# Altium schematic sheet FIT_TCM.SchDoc: FIT_PM12 board
size 420 x 297 mm; CheckedBy: G.Kasprowicz; Author: INR Moscow; CompanyName: WUT ISE; DrawnBy: M.Podgórski; Organization: WUT ISE; Address1: PW ISE; Address2: Nowowiejska 15/19 00-665 Warsaw; Address3: gkasprow@gmail.com; Revision: 2; SheetNumber: -; SheetTotal: -; ModifiedBy: -; CheckedDate: -; Title2: Title 2; DivGrp: WUT ISE; Designer: INR RAS; ModifiedDate: -; ProjectName: Sensor Box
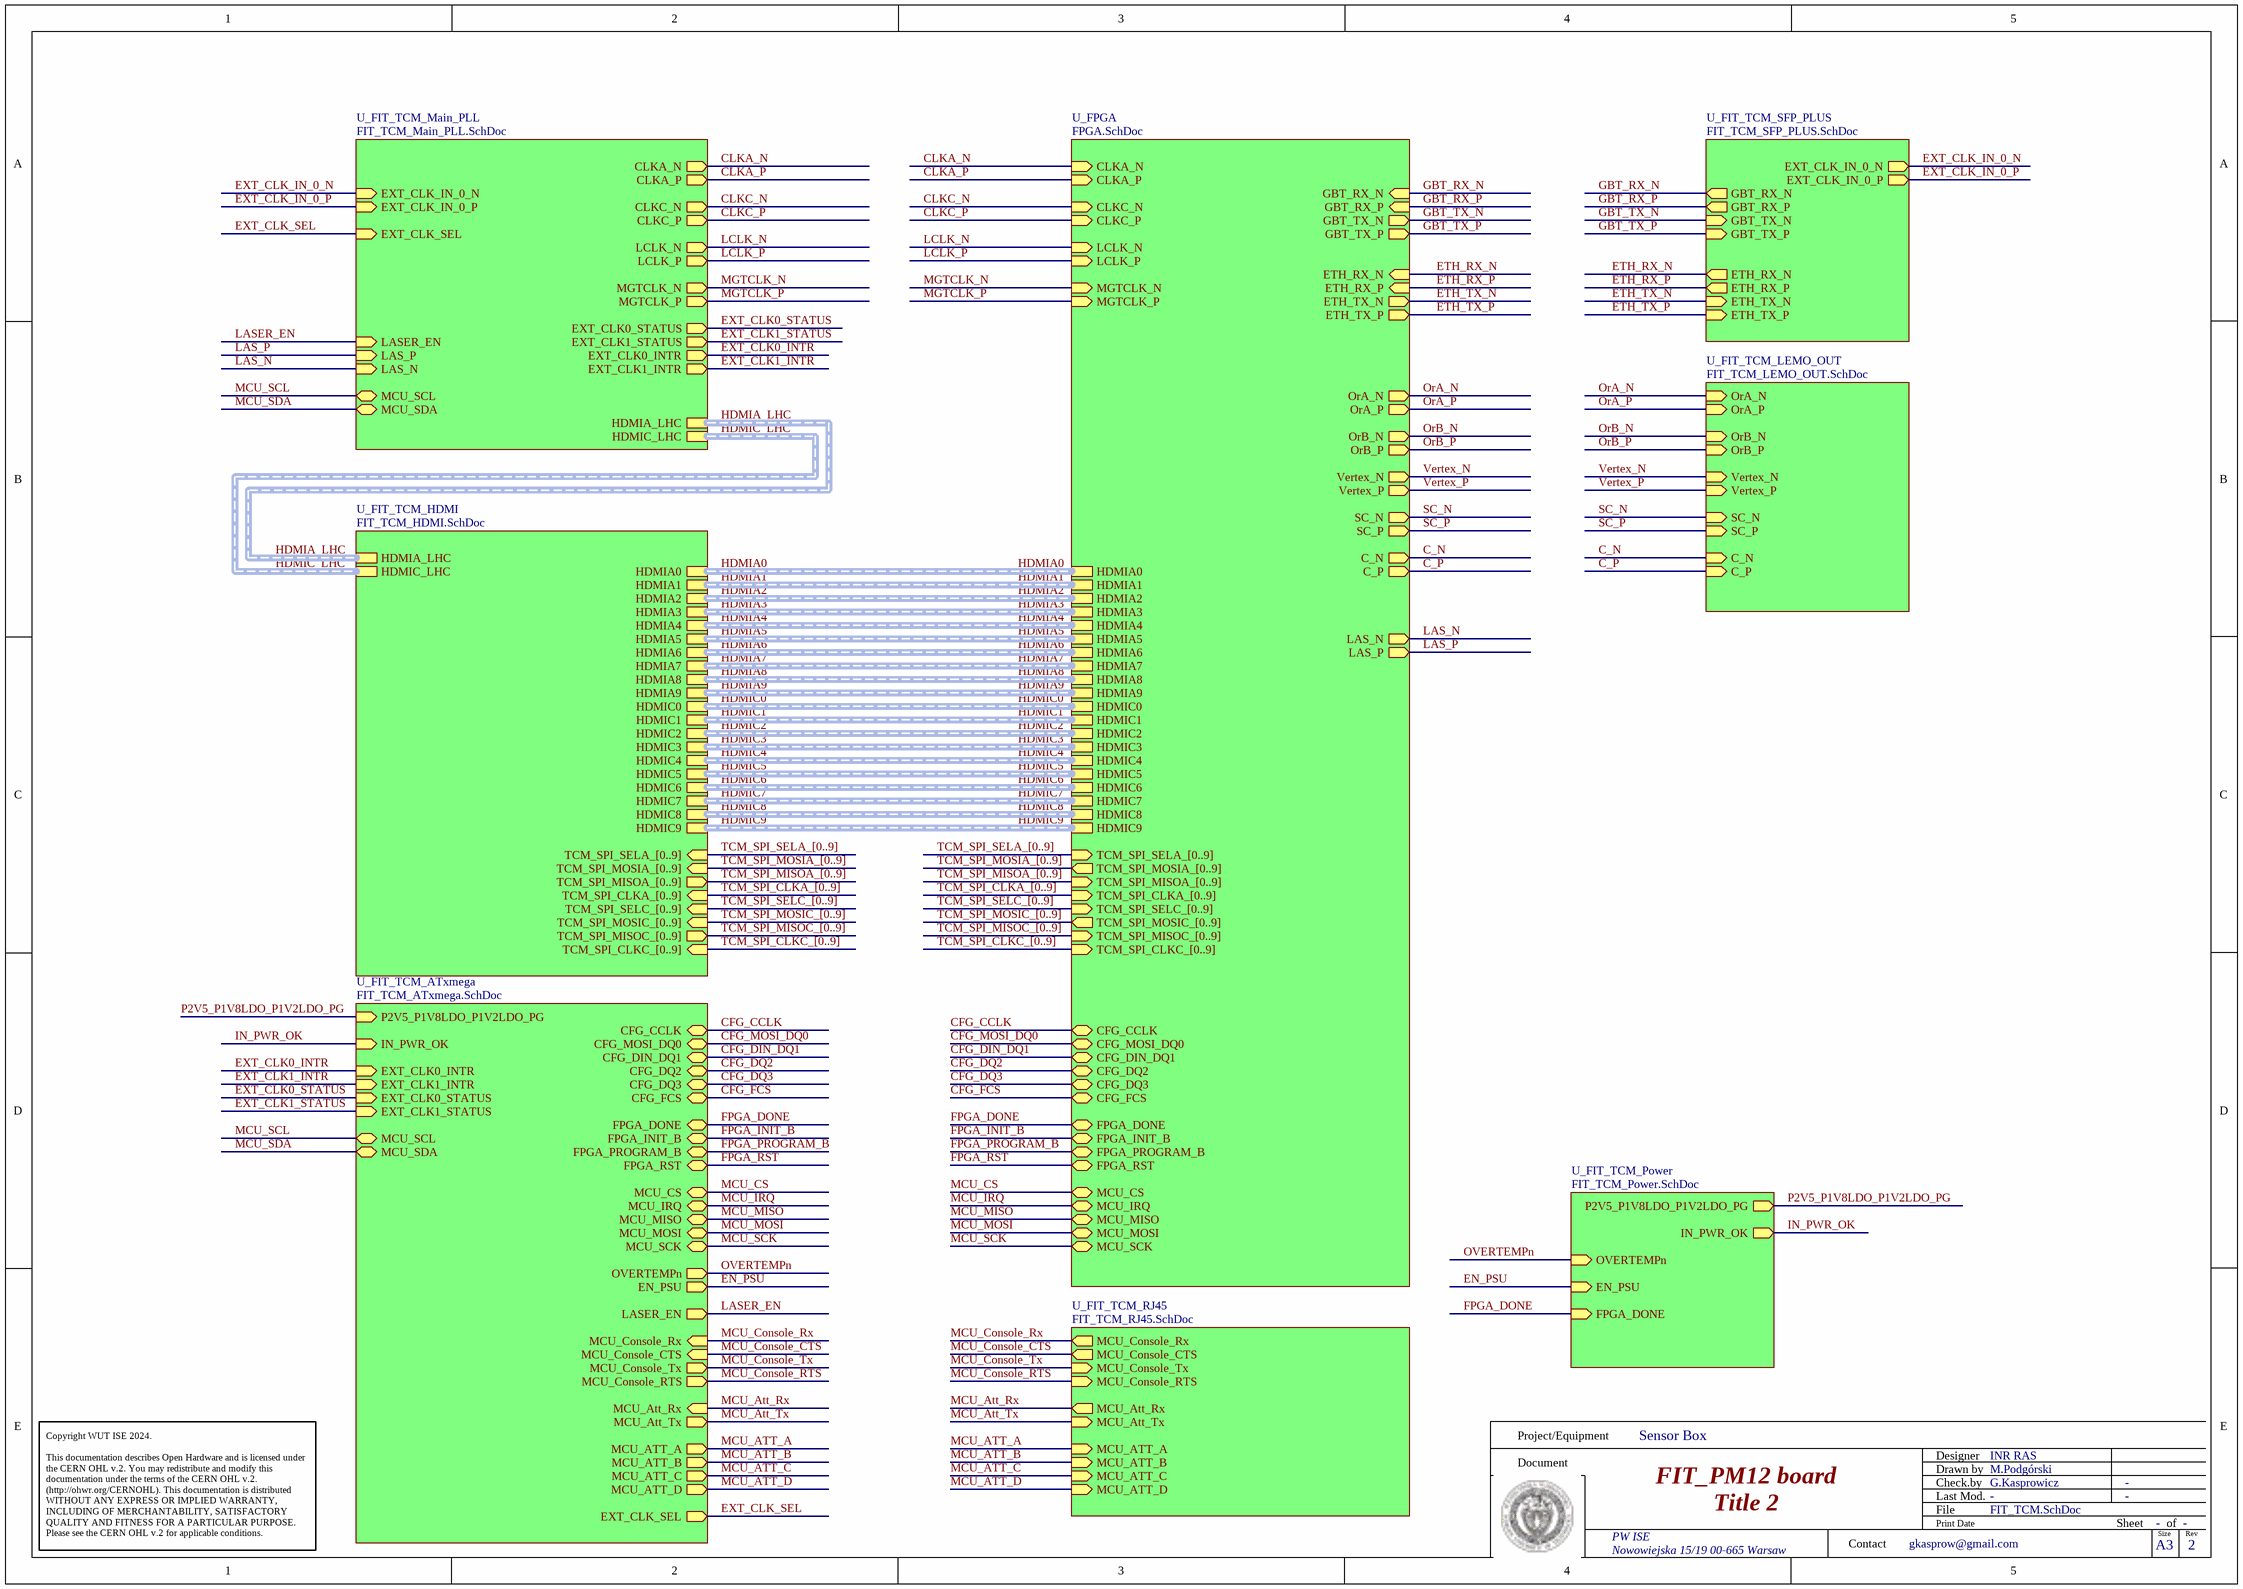
[diagram p0: FIT_TCM.SchDoc]

## Sub-sheets
U_FIT_TCM_ATxmega = FIT_TCM_ATxmega.SchDoc: IN_PWR_OK (in), P2V5_P1V8LDO_P1V2LDO_PG (in), MCU_ATT_A (out), MCU_ATT_C (out), MCU_ATT_B (out), MCU_ATT_D (out), MCU_Att_Rx (in), MCU_Att_Tx (out), MCU_Console_RTS (out), MCU_Console_CTS (in), MCU_Console_Rx (in), MCU_Console_Tx (out), EN_PSU (out), OVERTEMPn (out), LASER_EN (out), EXT_CLK_SEL (out), EXT_CLK0_STATUS (in), EXT_CLK1_STATUS (in), MCU_SDA (bidir), MCU_SCL (bidir), EXT_CLK0_INTR (in), EXT_CLK1_INTR (in), MCU_MISO (bidir), MCU_IRQ (bidir), MCU_MOSI (bidir), FPGA_RST (bidir), MCU_SCK (bidir), CFG_MOSI_DQ0 (bidir), CFG_DQ2 (bidir), CFG_DIN_DQ1 (bidir), CFG_DQ3 (bidir), CFG_FCS (bidir), CFG_CCLK (bidir), MCU_CS (bidir), FPGA_PROGRAM_B (bidir), FPGA_INIT_B (bidir), FPGA_DONE (bidir)
U_FIT_TCM_HDMI = FIT_TCM_HDMI.SchDoc: TCM_SPI_SELA_[0..9] (in), TCM_SPI_MOSIA_[0..9] (in), TCM_SPI_MISOA_[0..9] (out), TCM_SPI_CLKA_[0..9] (in), HDMIA_LHC (harness LHC_CLK), TCM_SPI_SELC_[0..9] (in), TCM_SPI_MOSIC_[0..9] (in), TCM_SPI_MISOC_[0..9] (out), TCM_SPI_CLKC_[0..9] (in), HDMIC_LHC (harness LHC_CLK), HDMIA0 (harness HDMI_SIG), HDMIA2 (harness HDMI_SIG), HDMIA3 (harness HDMI_SIG), HDMIA4 (harness HDMI_SIG), HDMIA5 (harness HDMI_SIG), HDMIA6 (harness HDMI_SIG), HDMIA7 (harness HDMI_SIG), HDMIA8 (harness HDMI_SIG), HDMIA9 (harness HDMI_SIG), HDMIC0 (harness HDMI_SIG), HDMIC1 (harness HDMI_SIG), HDMIC2 (harness HDMI_SIG), HDMIC3 (harness HDMI_SIG), HDMIC4 (harness HDMI_SIG), HDMIC5 (harness HDMI_SIG), HDMIC6 (harness HDMI_SIG), HDMIC7 (harness HDMI_SIG), HDMIC8 (harness HDMI_SIG), HDMIC9 (harness HDMI_SIG), HDMIA1 (harness HDMI_SIG)
U_FIT_TCM_LEMO_OUT = FIT_TCM_LEMO_OUT.SchDoc: OrA_P (in), OrA_N (in), SC_P (in), SC_N (in), C_P (in), C_N (in), OrB_P (in), OrB_N (in), Vertex_P (in), Vertex_N (in)
U_FIT_TCM_Main_PLL = FIT_TCM_Main_PLL.SchDoc: LASER_EN (in), EXT_CLK_SEL (in), EXT_CLK_IN_0_P (in), EXT_CLK_IN_0_N (in), EXT_CLK0_STATUS (out), EXT_CLK1_STATUS (out), LAS_P (in), LAS_N (in), EXT_CLK0_INTR (out), MCU_SCL (bidir), MCU_SDA (bidir), EXT_CLK1_INTR (out), MGTCLK_P (out), MGTCLK_N (out), CLKC_P (out), CLKC_N (out), CLKA_P (out), CLKA_N (out), LCLK_P (out), LCLK_N (out), HDMIA_LHC (harness LHC_CLK), HDMIC_LHC (harness LHC_CLK)
U_FIT_TCM_Power = FIT_TCM_Power.SchDoc: P2V5_P1V8LDO_P1V2LDO_PG (out), IN_PWR_OK (out), OVERTEMPn (in), EN_PSU (in), FPGA_DONE (in)
U_FIT_TCM_RJ45 = FIT_TCM_RJ45.SchDoc: MCU_ATT_A (in), MCU_ATT_C (in), MCU_ATT_B (in), MCU_ATT_D (in), MCU_Att_Rx (out), MCU_Att_Tx (in), MCU_Console_RTS (in), MCU_Console_CTS (out), MCU_Console_Rx (out), MCU_Console_Tx (in)
U_FIT_TCM_SFP_PLUS = FIT_TCM_SFP_PLUS.SchDoc: EXT_CLK_IN_0_P (out), EXT_CLK_IN_0_N (out), ETH_TX_P (in), ETH_TX_N (in), ETH_RX_P (out), ETH_RX_N (out), GBT_RX_P (out), GBT_RX_N (out), GBT_TX_P (in), GBT_TX_N (in)
U_FPGA = FPGA.SchDoc: CFG_CCLK (bidir), CFG_DIN_DQ1 (bidir), CFG_DQ2 (bidir), CFG_DQ3 (bidir), CFG_FCS (bidir), CFG_MOSI_DQ0 (bidir), CLKA_N (in), CLKA_P (in), CLKC_N (in), CLKC_P (in), C_N (out), C_P (out), ETH_RX_N (in), ETH_RX_P (in), ETH_TX_N (out), ETH_TX_P (out), FPGA_DONE (bidir), FPGA_INIT_B (bidir), FPGA_PROGRAM_B (bidir), FPGA_RST (bidir), GBT_RX_N (in), GBT_RX_P (in), GBT_TX_N (out), GBT_TX_P (out), LAS_N (out), LAS_P (out), LCLK_N (in), LCLK_P (in), MCU_CS (bidir), MCU_IRQ (bidir), MCU_MISO (bidir), MCU_MOSI (bidir), MCU_SCK (bidir), MGTCLK_N (in), MGTCLK_P (in), OrA_N (out), OrA_P (out), OrB_N (out), OrB_P (out), SC_N (out), SC_P (out), Vertex_N (out), Vertex_P (out), HDMIA0 (harness HDMI_SIG), HDMIA1 (harness HDMI_SIG), HDMIA2 (harness HDMI_SIG), HDMIA3 (harness HDMI_SIG), HDMIA4 (harness HDMI_SIG), HDMIA5 (harness HDMI_SIG), HDMIA6 (harness HDMI_SIG), HDMIA7 (harness HDMI_SIG), HDMIA8 (harness HDMI_SIG), HDMIA9 (harness HDMI_SIG), HDMIC0 (harness HDMI_SIG), HDMIC1 (harness HDMI_SIG), HDMIC2 (harness HDMI_SIG), HDMIC3 (harness HDMI_SIG), HDMIC4 (harness HDMI_SIG), HDMIC5 (harness HDMI_SIG), HDMIC6 (harness HDMI_SIG), HDMIC7 (harness HDMI_SIG), HDMIC8 (harness HDMI_SIG), HDMIC9 (harness HDMI_SIG), TCM_SPI_SELA_[0..9] (in), TCM_SPI_MOSIA_[0..9] (out), TCM_SPI_MISOA_[0..9] (in), TCM_SPI_CLKA_[0..9] (in), TCM_SPI_SELC_[0..9] (in), TCM_SPI_MOSIC_[0..9] (out), TCM_SPI_MISOC_[0..9] (in), TCM_SPI_CLKC_[0..9] (in)

## Nets
C_N: sheet U_FIT_TCM_LEMO_OUT/C_N, sheet U_FPGA/C_N
C_P: sheet U_FIT_TCM_LEMO_OUT/C_P, sheet U_FPGA/C_P
CFG_CCLK: sheet U_FIT_TCM_ATxmega/CFG_CCLK, sheet U_FPGA/CFG_CCLK
CFG_DIN_DQ1: sheet U_FIT_TCM_ATxmega/CFG_DIN_DQ1, sheet U_FPGA/CFG_DIN_DQ1
CFG_DQ2: sheet U_FIT_TCM_ATxmega/CFG_DQ2, sheet U_FPGA/CFG_DQ2
CFG_DQ3: sheet U_FIT_TCM_ATxmega/CFG_DQ3, sheet U_FPGA/CFG_DQ3
CFG_FCS: sheet U_FIT_TCM_ATxmega/CFG_FCS, sheet U_FPGA/CFG_FCS
CFG_MOSI_DQ0: sheet U_FIT_TCM_ATxmega/CFG_MOSI_DQ0, sheet U_FPGA/CFG_MOSI_DQ0
CLKA_N: sheet U_FIT_TCM_Main_PLL/CLKA_N, sheet U_FPGA/CLKA_N
CLKA_P: sheet U_FIT_TCM_Main_PLL/CLKA_P, sheet U_FPGA/CLKA_P
CLKC_N: sheet U_FIT_TCM_Main_PLL/CLKC_N, sheet U_FPGA/CLKC_N
CLKC_P: sheet U_FIT_TCM_Main_PLL/CLKC_P, sheet U_FPGA/CLKC_P
EN_PSU: sheet U_FIT_TCM_ATxmega/EN_PSU, sheet U_FIT_TCM_Power/EN_PSU
ETH_RX_N: sheet U_FIT_TCM_SFP_PLUS/ETH_RX_N, sheet U_FPGA/ETH_RX_N
ETH_RX_P: sheet U_FIT_TCM_SFP_PLUS/ETH_RX_P, sheet U_FPGA/ETH_RX_P
ETH_TX_N: sheet U_FIT_TCM_SFP_PLUS/ETH_TX_N, sheet U_FPGA/ETH_TX_N
ETH_TX_P: sheet U_FIT_TCM_SFP_PLUS/ETH_TX_P, sheet U_FPGA/ETH_TX_P
EXT_CLK0_INTR: sheet U_FIT_TCM_ATxmega/EXT_CLK0_INTR, sheet U_FIT_TCM_Main_PLL/EXT_CLK0_INTR
EXT_CLK0_STATUS: sheet U_FIT_TCM_ATxmega/EXT_CLK0_STATUS, sheet U_FIT_TCM_Main_PLL/EXT_CLK0_STATUS
EXT_CLK1_INTR: sheet U_FIT_TCM_ATxmega/EXT_CLK1_INTR, sheet U_FIT_TCM_Main_PLL/EXT_CLK1_INTR
EXT_CLK1_STATUS: sheet U_FIT_TCM_ATxmega/EXT_CLK1_STATUS, sheet U_FIT_TCM_Main_PLL/EXT_CLK1_STATUS
EXT_CLK_IN_0_N: sheet U_FIT_TCM_Main_PLL/EXT_CLK_IN_0_N, sheet U_FIT_TCM_SFP_PLUS/EXT_CLK_IN_0_N
EXT_CLK_IN_0_P: sheet U_FIT_TCM_Main_PLL/EXT_CLK_IN_0_P, sheet U_FIT_TCM_SFP_PLUS/EXT_CLK_IN_0_P
EXT_CLK_SEL: sheet U_FIT_TCM_ATxmega/EXT_CLK_SEL, sheet U_FIT_TCM_Main_PLL/EXT_CLK_SEL
FPGA_DONE: sheet U_FIT_TCM_ATxmega/FPGA_DONE, sheet U_FIT_TCM_Power/FPGA_DONE, sheet U_FPGA/FPGA_DONE
FPGA_INIT_B: sheet U_FIT_TCM_ATxmega/FPGA_INIT_B, sheet U_FPGA/FPGA_INIT_B
FPGA_PROGRAM_B: sheet U_FIT_TCM_ATxmega/FPGA_PROGRAM_B, sheet U_FPGA/FPGA_PROGRAM_B
FPGA_RST: sheet U_FIT_TCM_ATxmega/FPGA_RST, sheet U_FPGA/FPGA_RST
GBT_RX_N: sheet U_FIT_TCM_SFP_PLUS/GBT_RX_N, sheet U_FPGA/GBT_RX_N
GBT_RX_P: sheet U_FIT_TCM_SFP_PLUS/GBT_RX_P, sheet U_FPGA/GBT_RX_P
GBT_TX_N: sheet U_FIT_TCM_SFP_PLUS/GBT_TX_N, sheet U_FPGA/GBT_TX_N
GBT_TX_P: sheet U_FIT_TCM_SFP_PLUS/GBT_TX_P, sheet U_FPGA/GBT_TX_P
IN_PWR_OK: sheet U_FIT_TCM_ATxmega/IN_PWR_OK, sheet U_FIT_TCM_Power/IN_PWR_OK
LAS_N: sheet U_FIT_TCM_Main_PLL/LAS_N, sheet U_FPGA/LAS_N
LAS_P: sheet U_FIT_TCM_Main_PLL/LAS_P, sheet U_FPGA/LAS_P
LASER_EN: sheet U_FIT_TCM_ATxmega/LASER_EN, sheet U_FIT_TCM_Main_PLL/LASER_EN
LCLK_N: sheet U_FIT_TCM_Main_PLL/LCLK_N, sheet U_FPGA/LCLK_N
LCLK_P: sheet U_FIT_TCM_Main_PLL/LCLK_P, sheet U_FPGA/LCLK_P
MCU_ATT_A: sheet U_FIT_TCM_ATxmega/MCU_ATT_A, sheet U_FIT_TCM_RJ45/MCU_ATT_A
MCU_ATT_B: sheet U_FIT_TCM_ATxmega/MCU_ATT_B, sheet U_FIT_TCM_RJ45/MCU_ATT_B
MCU_ATT_C: sheet U_FIT_TCM_ATxmega/MCU_ATT_C, sheet U_FIT_TCM_RJ45/MCU_ATT_C
MCU_ATT_D: sheet U_FIT_TCM_ATxmega/MCU_ATT_D, sheet U_FIT_TCM_RJ45/MCU_ATT_D
MCU_Att_Rx: sheet U_FIT_TCM_ATxmega/MCU_Att_Rx, sheet U_FIT_TCM_RJ45/MCU_Att_Rx
MCU_Att_Tx: sheet U_FIT_TCM_ATxmega/MCU_Att_Tx, sheet U_FIT_TCM_RJ45/MCU_Att_Tx
MCU_Console_CTS: sheet U_FIT_TCM_ATxmega/MCU_Console_CTS, sheet U_FIT_TCM_RJ45/MCU_Console_CTS
MCU_Console_RTS: sheet U_FIT_TCM_ATxmega/MCU_Console_RTS, sheet U_FIT_TCM_RJ45/MCU_Console_RTS
MCU_Console_Rx: sheet U_FIT_TCM_ATxmega/MCU_Console_Rx, sheet U_FIT_TCM_RJ45/MCU_Console_Rx
MCU_Console_Tx: sheet U_FIT_TCM_ATxmega/MCU_Console_Tx, sheet U_FIT_TCM_RJ45/MCU_Console_Tx
MCU_CS: sheet U_FIT_TCM_ATxmega/MCU_CS, sheet U_FPGA/MCU_CS
MCU_IRQ: sheet U_FIT_TCM_ATxmega/MCU_IRQ, sheet U_FPGA/MCU_IRQ
MCU_MISO: sheet U_FIT_TCM_ATxmega/MCU_MISO, sheet U_FPGA/MCU_MISO
MCU_MOSI: sheet U_FIT_TCM_ATxmega/MCU_MOSI, sheet U_FPGA/MCU_MOSI
MCU_SCK: sheet U_FIT_TCM_ATxmega/MCU_SCK, sheet U_FPGA/MCU_SCK
MCU_SCL: sheet U_FIT_TCM_ATxmega/MCU_SCL, sheet U_FIT_TCM_Main_PLL/MCU_SCL
MCU_SDA: sheet U_FIT_TCM_ATxmega/MCU_SDA, sheet U_FIT_TCM_Main_PLL/MCU_SDA
MGTCLK_N: sheet U_FIT_TCM_Main_PLL/MGTCLK_N, sheet U_FPGA/MGTCLK_N
MGTCLK_P: sheet U_FIT_TCM_Main_PLL/MGTCLK_P, sheet U_FPGA/MGTCLK_P
OrA_N: sheet U_FIT_TCM_LEMO_OUT/OrA_N, sheet U_FPGA/OrA_N
OrA_P: sheet U_FIT_TCM_LEMO_OUT/OrA_P, sheet U_FPGA/OrA_P
OrB_N: sheet U_FIT_TCM_LEMO_OUT/OrB_N, sheet U_FPGA/OrB_N
OrB_P: sheet U_FIT_TCM_LEMO_OUT/OrB_P, sheet U_FPGA/OrB_P
OVERTEMPn: sheet U_FIT_TCM_ATxmega/OVERTEMPn, sheet U_FIT_TCM_Power/OVERTEMPn
P2V5_P1V8LDO_P1V2LDO_PG: sheet U_FIT_TCM_ATxmega/P2V5_P1V8LDO_P1V2LDO_PG, sheet U_FIT_TCM_Power/P2V5_P1V8LDO_P1V2LDO_PG
SC_N: sheet U_FIT_TCM_LEMO_OUT/SC_N, sheet U_FPGA/SC_N
SC_P: sheet U_FIT_TCM_LEMO_OUT/SC_P, sheet U_FPGA/SC_P
Vertex_N: sheet U_FIT_TCM_LEMO_OUT/Vertex_N, sheet U_FPGA/Vertex_N
Vertex_P: sheet U_FIT_TCM_LEMO_OUT/Vertex_P, sheet U_FPGA/Vertex_P

## Buses and harness runs
bus TCM_SPI_CLKA_[0..9] = sheet U_FIT_TCM_HDMI/TCM_SPI_CLKA_[0..9]
bus TCM_SPI_CLKA_[0..9] = sheet U_FPGA/TCM_SPI_CLKA_[0..9]
bus TCM_SPI_CLKC_[0..9] = sheet U_FIT_TCM_HDMI/TCM_SPI_CLKC_[0..9]
bus TCM_SPI_CLKC_[0..9] = sheet U_FPGA/TCM_SPI_CLKC_[0..9]
bus TCM_SPI_MISOA_[0..9] = sheet U_FIT_TCM_HDMI/TCM_SPI_MISOA_[0..9]
bus TCM_SPI_MISOA_[0..9] = sheet U_FPGA/TCM_SPI_MISOA_[0..9]
bus TCM_SPI_MISOC_[0..9] = sheet U_FIT_TCM_HDMI/TCM_SPI_MISOC_[0..9]
bus TCM_SPI_MISOC_[0..9] = sheet U_FPGA/TCM_SPI_MISOC_[0..9]
bus TCM_SPI_MOSIA_[0..9] = sheet U_FIT_TCM_HDMI/TCM_SPI_MOSIA_[0..9]
bus TCM_SPI_MOSIA_[0..9] = sheet U_FPGA/TCM_SPI_MOSIA_[0..9]
bus TCM_SPI_MOSIC_[0..9] = sheet U_FIT_TCM_HDMI/TCM_SPI_MOSIC_[0..9]
bus TCM_SPI_MOSIC_[0..9] = sheet U_FPGA/TCM_SPI_MOSIC_[0..9]
bus TCM_SPI_SELA_[0..9] = sheet U_FIT_TCM_HDMI/TCM_SPI_SELA_[0..9]
bus TCM_SPI_SELA_[0..9] = sheet U_FPGA/TCM_SPI_SELA_[0..9]
bus TCM_SPI_SELC_[0..9] = sheet U_FIT_TCM_HDMI/TCM_SPI_SELC_[0..9]
bus TCM_SPI_SELC_[0..9] = sheet U_FPGA/TCM_SPI_SELC_[0..9]
harness HDMIA0 = sheet U_FIT_TCM_HDMI/HDMIA0 = sheet U_FPGA/HDMIA0
harness HDMIA1 = sheet U_FIT_TCM_HDMI/HDMIA1 = sheet U_FPGA/HDMIA1
harness HDMIA2 = sheet U_FIT_TCM_HDMI/HDMIA2 = sheet U_FPGA/HDMIA2
harness HDMIA3 = sheet U_FIT_TCM_HDMI/HDMIA3 = sheet U_FPGA/HDMIA3
harness HDMIA4 = sheet U_FIT_TCM_HDMI/HDMIA4 = sheet U_FPGA/HDMIA4
harness HDMIA5 = sheet U_FIT_TCM_HDMI/HDMIA5 = sheet U_FPGA/HDMIA5
harness HDMIA6 = sheet U_FIT_TCM_HDMI/HDMIA6 = sheet U_FPGA/HDMIA6
harness HDMIA7 = sheet U_FIT_TCM_HDMI/HDMIA7 = sheet U_FPGA/HDMIA7
harness HDMIA8 = sheet U_FIT_TCM_HDMI/HDMIA8 = sheet U_FPGA/HDMIA8
harness HDMIA9 = sheet U_FIT_TCM_HDMI/HDMIA9 = sheet U_FPGA/HDMIA9
harness HDMIA_LHC = sheet U_FIT_TCM_HDMI/HDMIA_LHC = sheet U_FIT_TCM_Main_PLL/HDMIA_LHC
harness HDMIC0 = sheet U_FIT_TCM_HDMI/HDMIC0 = sheet U_FPGA/HDMIC0
harness HDMIC1 = sheet U_FIT_TCM_HDMI/HDMIC1 = sheet U_FPGA/HDMIC1
harness HDMIC2 = sheet U_FIT_TCM_HDMI/HDMIC2 = sheet U_FPGA/HDMIC2
harness HDMIC3 = sheet U_FIT_TCM_HDMI/HDMIC3 = sheet U_FPGA/HDMIC3
harness HDMIC4 = sheet U_FIT_TCM_HDMI/HDMIC4 = sheet U_FPGA/HDMIC4
harness HDMIC5 = sheet U_FIT_TCM_HDMI/HDMIC5 = sheet U_FPGA/HDMIC5
harness HDMIC6 = sheet U_FIT_TCM_HDMI/HDMIC6 = sheet U_FPGA/HDMIC6
harness HDMIC7 = sheet U_FIT_TCM_HDMI/HDMIC7 = sheet U_FPGA/HDMIC7
harness HDMIC8 = sheet U_FIT_TCM_HDMI/HDMIC8 = sheet U_FPGA/HDMIC8
harness HDMIC9 = sheet U_FIT_TCM_HDMI/HDMIC9 = sheet U_FPGA/HDMIC9
harness HDMIC_LHC = sheet U_FIT_TCM_HDMI/HDMIC_LHC = sheet U_FIT_TCM_Main_PLL/HDMIC_LHC

## Notes on the sheet
- Project/Equipment
- Document
- Designer
- Drawn by
- Check.by
- Copyright WUT ISE 2024.
  This documentation describes Open Hardware and is licensed under the CERN OHL v.2. You may redistribute and modify this documentation under the terms of the CERN OHL v.2. (http://ohwr.org/CERNOHL). This documentation is distributed WITHOUT ANY EXPRESS OR IMPLIED WARRANTY, INCLUDING OF MERCHANTABILITY, SATISFACTORY QUALITY AND FITNESS FOR A PARTICULAR PURPOSE. Please see the CERN OHL v.2 for applicable conditions.
- Contact
- File
- Last Mod.
- Print Date
- Sheet
- Size
- A3
- of
- Rev